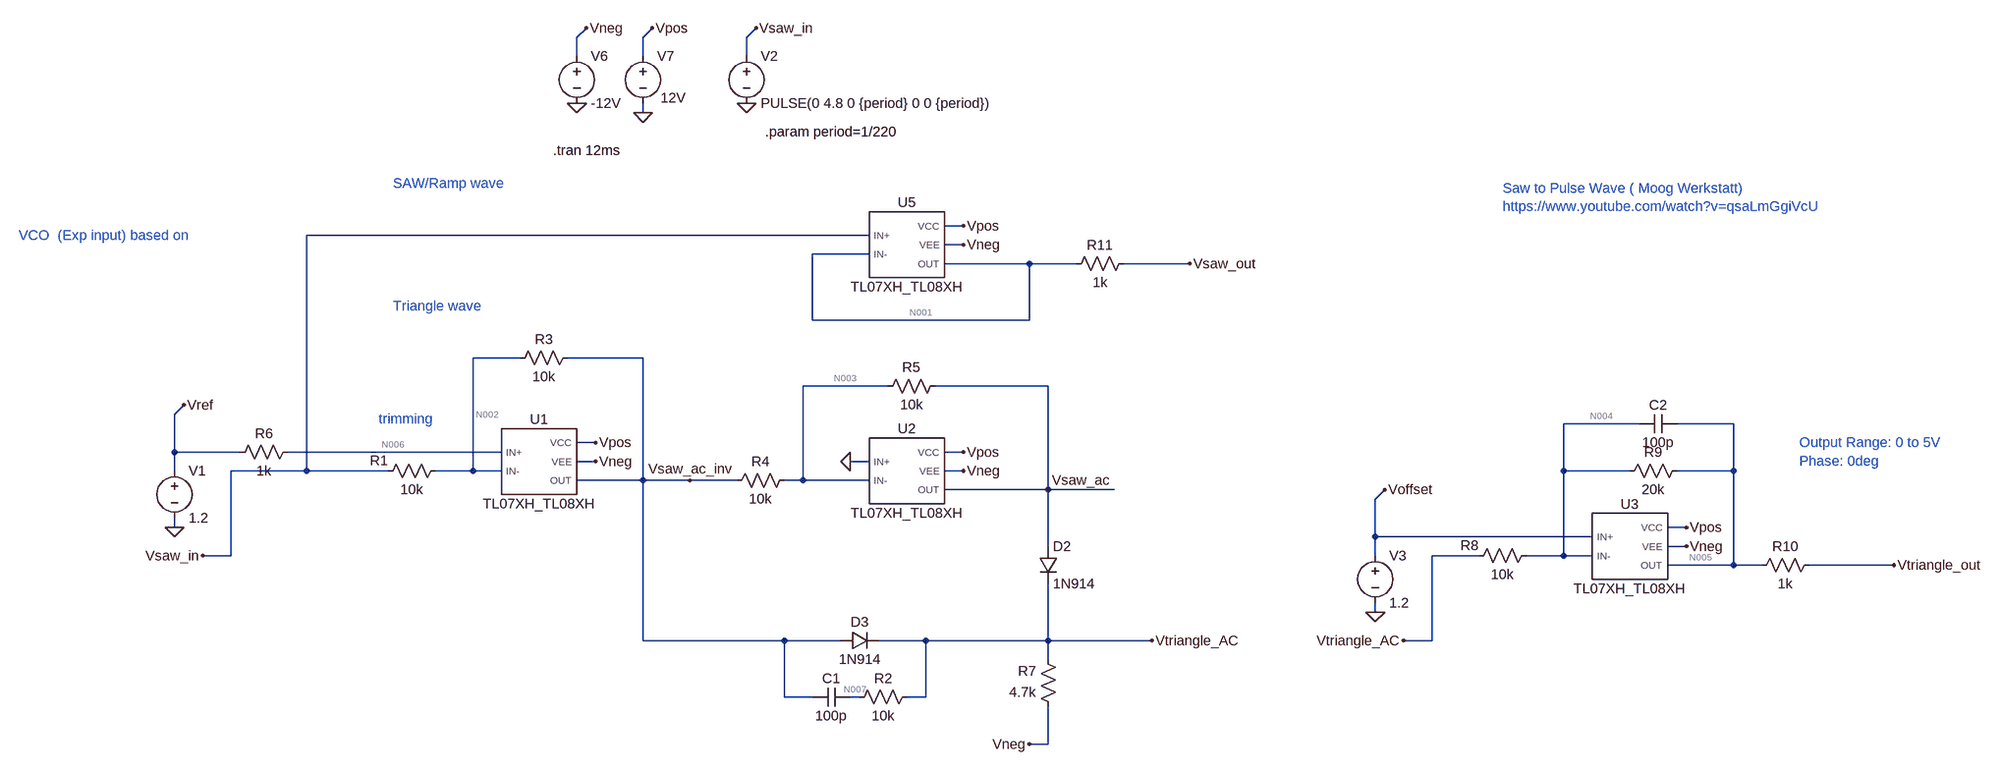
[diagram p0: schematic main_SAW_to_TRIAN.asc]
main_SAW_to_TRIAN.asc, the LTspice schematic file:
Version 4
SHEET 1 3072 1764
WIRE -2080 -592 -2064 -608
WIRE -1968 -592 -1952 -608
WIRE -1792 -592 -1776 -608
WIRE -2080 -560 -2080 -592
WIRE -1968 -560 -1968 -592
WIRE -1792 -560 -1792 -592
WIRE -1968 -464 -1968 -480
WIRE -1424 -272 -1456 -272
WIRE -1584 -256 -2544 -256
WIRE -1424 -240 -1456 -240
WIRE -1584 -224 -1680 -224
WIRE -1312 -208 -1456 -208
WIRE -1232 -208 -1312 -208
WIRE -1040 -208 -1152 -208
WIRE -1680 -112 -1680 -224
WIRE -1312 -112 -1312 -208
WIRE -1312 -112 -1680 -112
WIRE -2176 -48 -2256 -48
WIRE -1968 -48 -2096 -48
WIRE -1552 0 -1696 0
WIRE -1280 0 -1472 0
WIRE -2768 48 -2752 32
WIRE -272 64 -400 64
WIRE -112 64 -208 64
WIRE -2048 96 -2080 96
WIRE -2768 112 -2768 48
WIRE -2656 112 -2768 112
WIRE -2208 112 -2576 112
WIRE -1424 112 -1456 112
WIRE -2048 128 -2080 128
WIRE -1584 128 -1616 128
WIRE -2768 144 -2768 112
WIRE -2544 144 -2544 -256
WIRE -2544 144 -2672 144
WIRE -2400 144 -2544 144
WIRE -2256 144 -2256 -48
WIRE -2256 144 -2320 144
WIRE -2208 144 -2256 144
WIRE -1424 144 -1456 144
WIRE -400 144 -400 64
WIRE -288 144 -400 144
WIRE -112 144 -112 64
WIRE -112 144 -208 144
WIRE -1968 160 -1968 -48
WIRE -1968 160 -2080 160
WIRE -1888 160 -1968 160
WIRE -1808 160 -1888 160
WIRE -1696 160 -1696 0
WIRE -1696 160 -1728 160
WIRE -1584 160 -1696 160
WIRE -1280 176 -1280 0
WIRE -1280 176 -1456 176
WIRE -1168 176 -1280 176
WIRE -720 192 -704 176
WIRE -2768 240 -2768 224
WIRE -192 240 -224 240
WIRE -720 256 -720 192
WIRE -352 256 -720 256
WIRE -1280 272 -1280 176
WIRE -192 272 -224 272
WIRE -2672 288 -2672 144
WIRE -2672 288 -2720 288
WIRE -720 288 -720 256
WIRE -544 288 -624 288
WIRE -400 288 -400 144
WIRE -400 288 -464 288
WIRE -352 288 -400 288
WIRE -112 304 -112 144
WIRE -112 304 -224 304
WIRE -64 304 -112 304
WIRE 160 304 16 304
WIRE -720 384 -720 368
WIRE -1968 432 -1968 160
WIRE -1728 432 -1968 432
WIRE -1632 432 -1728 432
WIRE -1488 432 -1568 432
WIRE -1280 432 -1280 336
WIRE -1280 432 -1488 432
WIRE -1104 432 -1280 432
WIRE -624 432 -624 288
WIRE -624 432 -672 432
WIRE -1280 464 -1280 432
WIRE -1728 528 -1728 432
WIRE -1680 528 -1728 528
WIRE -1600 528 -1616 528
WIRE -1488 528 -1488 432
WIRE -1488 528 -1520 528
WIRE -1280 608 -1280 544
WIRE -1280 608 -1312 608
FLAG -2080 -480 0
FLAG -1968 -464 0
FLAG -2064 -608 Vneg
FLAG -1952 -608 Vpos
FLAG -1792 -480 0
FLAG -1776 -608 Vsaw_in
FLAG -2048 128 Vneg
FLAG -2048 96 Vpos
FLAG -2720 288 Vsaw_in
FLAG -1424 144 Vneg
FLAG -1424 112 Vpos
FLAG -1616 128 0
FLAG -1312 608 Vneg
FLAG -1888 160 Vsaw_ac_inv
FLAG -2768 240 0
FLAG -2752 32 Vref
FLAG -1104 432 Vtriangle_AC
FLAG -1280 176 Vsaw_ac
FLAG -192 272 Vneg
FLAG -192 240 Vpos
FLAG -720 384 0
FLAG -704 176 Voffset
FLAG -672 432 Vtriangle_AC
FLAG 160 304 Vtriangle_out
FLAG -1424 -240 Vneg
FLAG -1424 -272 Vpos
FLAG -1040 -208 Vsaw_out
SYMBOL voltage -2080 -576 R0
WINDOW 123 0 0 Left 0
WINDOW 39 0 0 Left 0
SYMATTR InstName V6
SYMATTR Value -12V
SYMBOL voltage -1968 -576 R0
WINDOW 123 0 0 Left 0
WINDOW 39 0 0 Left 0
WINDOW 3 30 87 Left 2
SYMATTR Value 12V
SYMATTR InstName V7
SYMBOL voltage -1792 -576 R0
WINDOW 123 0 0 Left 0
WINDOW 39 0 0 Left 0
SYMATTR InstName V2
SYMATTR Value PULSE(0 4.8 0 {period} 0 0 {period})
SYMBOL TL07XH_TL08XH -2144 128 R0
SYMATTR InstName U1
SYMBOL res -2304 128 R90
WINDOW 0 14 112 VBottom 2
WINDOW 3 32 56 VTop 2
SYMATTR InstName R1
SYMATTR Value 10k
SYMBOL res -2080 -64 R90
WINDOW 0 0 56 VBottom 2
WINDOW 3 32 56 VTop 2
SYMATTR InstName R3
SYMATTR Value 10k
SYMBOL TL07XH_TL08XH -1520 144 R0
SYMATTR InstName U2
SYMBOL res -1712 144 R90
WINDOW 0 0 56 VBottom 2
WINDOW 3 32 56 VTop 2
SYMATTR InstName R4
SYMATTR Value 10k
SYMBOL res -1456 -16 R90
WINDOW 0 0 56 VBottom 2
WINDOW 3 32 56 VTop 2
SYMATTR InstName R5
SYMATTR Value 10k
SYMBOL diode -1296 272 R0
SYMATTR InstName D2
SYMATTR Value 1N914
SYMBOL diode -1632 448 R270
WINDOW 0 32 32 VTop 2
WINDOW 3 0 32 VBottom 2
SYMATTR InstName D3
SYMATTR Value 1N914
SYMBOL voltage -2768 128 R0
WINDOW 123 0 0 Left 0
WINDOW 39 0 0 Left 0
SYMATTR InstName V1
SYMATTR Value 1.2
SYMBOL cap -1616 512 R90
WINDOW 0 0 32 VBottom 2
WINDOW 3 32 32 VTop 2
SYMATTR InstName C1
SYMATTR Value 100p
SYMBOL res -1616 544 R270
WINDOW 0 32 56 VTop 2
WINDOW 3 0 56 VBottom 2
SYMATTR InstName R2
SYMATTR Value 10k
SYMBOL TL07XH_TL08XH -288 272 R0
SYMATTR InstName U3
SYMBOL res -448 272 R90
WINDOW 0 14 112 VBottom 2
WINDOW 3 32 56 VTop 2
SYMATTR InstName R8
SYMATTR Value 10k
SYMBOL res -192 128 R90
WINDOW 0 0 56 VBottom 2
WINDOW 3 32 56 VTop 2
SYMATTR InstName R9
SYMATTR Value 20k
SYMBOL voltage -720 272 R0
WINDOW 123 0 0 Left 0
WINDOW 39 0 0 Left 0
SYMATTR InstName V3
SYMATTR Value 1.2
SYMBOL cap -208 48 R90
WINDOW 0 0 32 VBottom 2
WINDOW 3 32 32 VTop 2
SYMATTR InstName C2
SYMATTR Value 100p
SYMBOL res 32 288 R90
WINDOW 0 0 56 VBottom 2
WINDOW 3 32 56 VTop 2
SYMATTR InstName R10
SYMATTR Value 1k
SYMBOL res -1264 560 R180
WINDOW 0 36 76 Left 2
WINDOW 3 36 40 Left 2
SYMATTR InstName R7
SYMATTR Value 4.7k
SYMBOL TL07XH_TL08XH -1520 -240 R0
SYMATTR InstName U5
SYMBOL res -1136 -224 R90
WINDOW 0 0 56 VBottom 2
WINDOW 3 32 56 VTop 2
SYMATTR InstName R11
SYMATTR Value 1k
SYMBOL res -2560 96 R90
WINDOW 0 0 56 VBottom 2
WINDOW 3 32 56 VTop 2
SYMATTR InstName R6
SYMATTR Value 1k
TEXT -3032 -256 Left 2 ;VCO  (Exp input) based on
TEXT -1760 -432 Left 2 !.param period=1/220
TEXT -2120 -400 Left 2 !.tran 12ms
TEXT -2416 56 Left 2 ;trimming
TEXT -2392 -344 Left 2 ;SAW/Ramp wave
TEXT -504 -336 Left 2 ;Saw to Pulse Wave ( Moog Werkstatt)\nhttps://www.youtube.com/watch?v=qsaLmGgiVcU
TEXT -2392 -136 Left 2 ;Triangle wave
TEXT 0 96 Left 2 ;Output Range: 0 to 5V\nPhase: 0deg

The netlist it stands for:
* main_SAW_to_TRIAN.asc
V6 Vneg 0 -12V
V7 Vpos 0 12V
V2 Vsaw_in 0 PULSE(0 4.8 0 {period} 0 0 {period})
XU1 N006 N002 Vpos Vneg Vsaw_ac_inv TL07XH_TL08XH  ; pins IN+ IN- VCC VEE OUT
R1 N002 Vsaw_in 10k
R3 Vsaw_ac_inv N002 10k
XU2 0 N003 Vpos Vneg Vsaw_ac TL07XH_TL08XH  ; pins IN+ IN- VCC VEE OUT
R4 N003 Vsaw_ac_inv 10k
R5 Vsaw_ac N003 10k
D2 Vsaw_ac Vtriangle_AC 1N914
D3 Vsaw_ac_inv Vtriangle_AC 1N914
V1 Vref 0 1.2
C1 N007 Vsaw_ac_inv 100p
R2 N007 Vtriangle_AC 10k
XU3 Voffset N004 Vpos Vneg N005 TL07XH_TL08XH  ; pins IN+ IN- VCC VEE OUT
R8 N004 Vtriangle_AC 10k
R9 N005 N004 20k
V3 Voffset 0 1.2
C2 N005 N004 100p
R10 Vtriangle_out N005 1k
R7 Vneg Vtriangle_AC 4.7k
XU5 Vsaw_in N001 Vpos Vneg N001 TL07XH_TL08XH  ; pins IN+ IN- VCC VEE OUT
R11 Vsaw_out N001 1k
R6 N006 Vref 1k
.model D D
.lib standard.dio
* VCO  (Exp input) based on
.param period=1/220
.tran 12ms
* trimming
* SAW/Ramp wave
* Saw to Pulse Wave ( Moog Werkstatt)
* https://www.youtube.com/watch?v=qsaLmGgiVcU
* Triangle wave
* Output Range: 0 to 5V
* Phase: 0deg
.lib C:\HOME_projects\SYNTH_GOOM\2LineartoExponential\tl07xh_tl08xh.lib
.backanno
.end

* Results of the author's LTspice run, read from the files saved beside the schematic
* Operating Point, zero values left out:
*   V(vneg) = -12 V
*   V(vpos) = 12 V
*   V(vsaw_ac_inv) = 2.391 V
*   V(n002) = 1.196 V
*   V(n006) = 1.2 V
*   V(vsaw_ac) = -2.4 V
*   V(n003) = -4.427 mV
*   V(vtriangle_ac) = 1.756 V
*   V(vref) = 1.2 V
*   V(n007) = 1.756 V
*   V(n005) = 75.21 mV
*   V(n004) = 1.196 V
*   V(voffset) = 1.2 V
*   V(vtriangle_out) = 75.21 mV
*   V(n001) = -4.428 mV
*   V(vsaw_out) = -4.428 mV
*   I(D3) = 2.983 mA
*   I(D2) = -2.524 nA
*   I(R6) = -7.032 pA
*   I(R7) = -2.927 mA
*   I(R9) = -56.02 µA
*   I(R8) = -56.02 µA
*   I(R5) = -239.6 µA
*   I(R4) = -239.6 µA
*   I(R3) = 119.6 µA
*   I(R1) = 119.6 µA
*   I(V3) = -7.091 pA
*   I(V1) = -7.032 pA
*   I(V2) = 119.6 µA
*   I(V7) = -7.092 mA
*   I(V6) = 6.972 mA
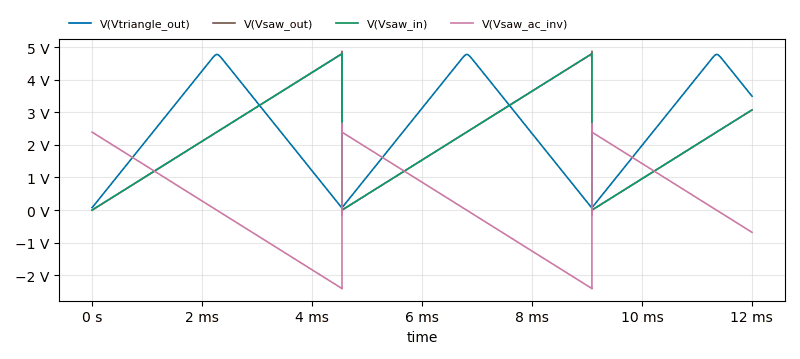
[diagram p1: Transient Analysis of main_SAW_to_TRIAN.asc, plotted from the saved traces]
* Transient Analysis, 1 run:
*   V(Vtriangle_out): min 60.29 mV, max 4.776 V, average 2.545 V, rms 2.941 V, last 3.495 V
*   V(Vsaw_out): min -152 mV, max 4.874 V, average 2.186 V, rms 2.573 V, last 3.07 V
*   V(Vsaw_in): min 0 V, max 4.8 V, average 2.191 V, rms 2.576 V, last 3.075 V
*   V(Vsaw_ac_inv): min -2.418 V, max 2.651 V, average 200.4 mV, rms 1.37 V, last -683.3 mV